# EAGLE design MKL02Z_breakout (EAGLE 7.4.0)
OBC with integrated microcontroller
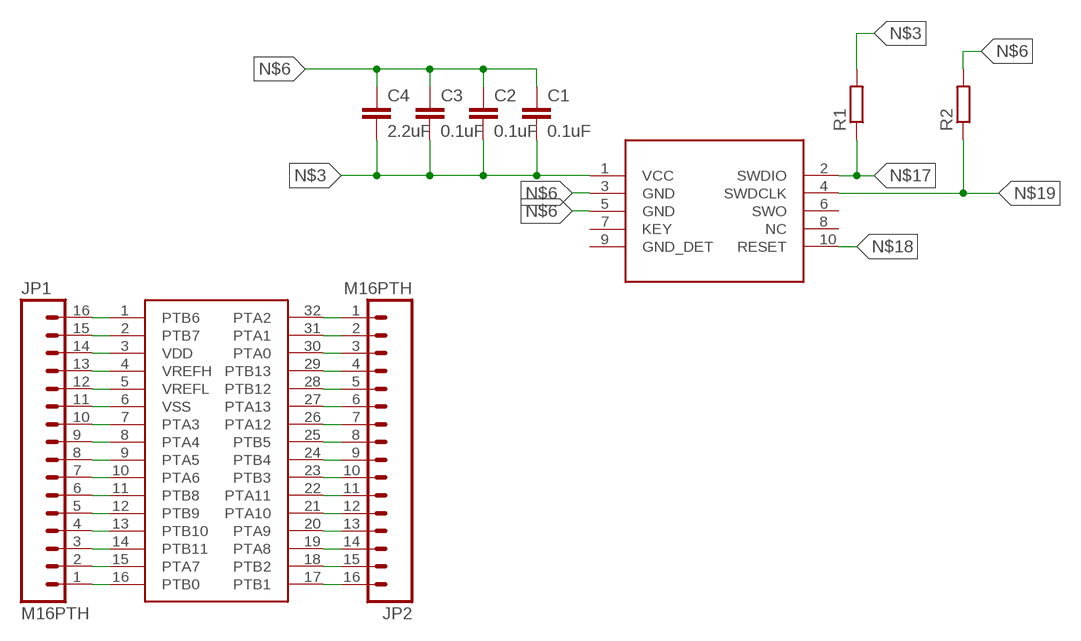
[diagram p0: schematic, sheet 1]

## Parts
C1  0.1uF  C-EUC0603  [C0603]
C2  0.1uF  C-EUC0603  [C0603]
C3  0.1uF  C-EUC0603  [C0603]
C4  2.2uF  C-EUC0603  [C0603]
JP1  M16PTH  [1X16]
JP2  M16PTH  [1X16]
R1  R-EU_R0603  [R0603]
R2  R-EU_R0603  [R0603]
U$1  MKL02Z16VFM4  [MKL02Z16VFM4]
U$2  SWD_10_PIN  [SWD_10_PIN]

## Nets
N$1: JP1.16 U$1.1(PTB6)
N$2: JP1.15 U$1.2(PTB7)
N$3: C1.2 C2.2 C3.2 C4.2 JP1.14 R1.2 U$1.3(VDD) U$2.1(VCC)
N$4: JP1.13 U$1.4(VREFH)
N$5: JP1.12 U$1.5(VREFL)
N$6: C1.1 C2.1 C3.1 C4.1 JP1.11 R2.2 U$1.6(VSS) U$2.3(GND) U$2.5(GND)
N$7: JP1.10 U$1.7(PTA3)
N$8: JP1.9 U$1.8(PTA4)
N$9: JP1.8 U$1.9(PTA5)
N$10: JP1.7 U$1.10(PTA6)
N$11: JP1.6 U$1.11(PTB8)
N$12: JP1.5 U$1.12(PTB9)
N$13: JP1.4 U$1.13(PTB10)
N$14: JP1.3 U$1.14(PTB11)
N$15: JP1.2 U$1.15(PTA7)
N$16: JP1.1 U$1.16(PTB0)
N$17: JP2.1 R1.1 U$1.32(PTA2) U$2.2(SWDIO)
N$18: JP2.2 U$1.31(PTA1) U$2.10(RESET)
N$19: JP2.3 R2.1 U$1.30(PTA0) U$2.4(SWDCLK)
N$20: JP2.4 U$1.29(PTB13)
N$21: JP2.5 U$1.28(PTB12)
N$22: JP2.6 U$1.27(PTA13)
N$23: JP2.7 U$1.26(PTA12)
N$24: JP2.8 U$1.25(PTB5)
N$25: JP2.9 U$1.24(PTB4)
N$26: JP2.10 U$1.23(PTB3)
N$27: JP2.11 U$1.22(PTA11)
N$28: JP2.12 U$1.21(PTA10)
N$29: JP2.13 U$1.20(PTA9)
N$30: JP2.14 U$1.19(PTA8)
N$31: JP2.15 U$1.18(PTB2)
N$32: JP2.16 U$1.17(PTB1)
Unconnected: U$2.6(SWO) U$2.7(KEY) U$2.8(NC) U$2.9(GND_DET)

## Library data of the parts
C1-C4 = resistor:C-EU: CAPACITOR, European symbol
JP1 JP2 = SparkFun-Connectors:M16: 1x16 .1" header
R1 R2 = resistor:R-EU_: RESISTOR, European symbol
U$1 = OBC:MKL02Z16VFM4
U$2 = OBC:SWD_10_PIN

## Net classes
1 USB: width 0.254 mm, clearance 0.159 mm

## Board
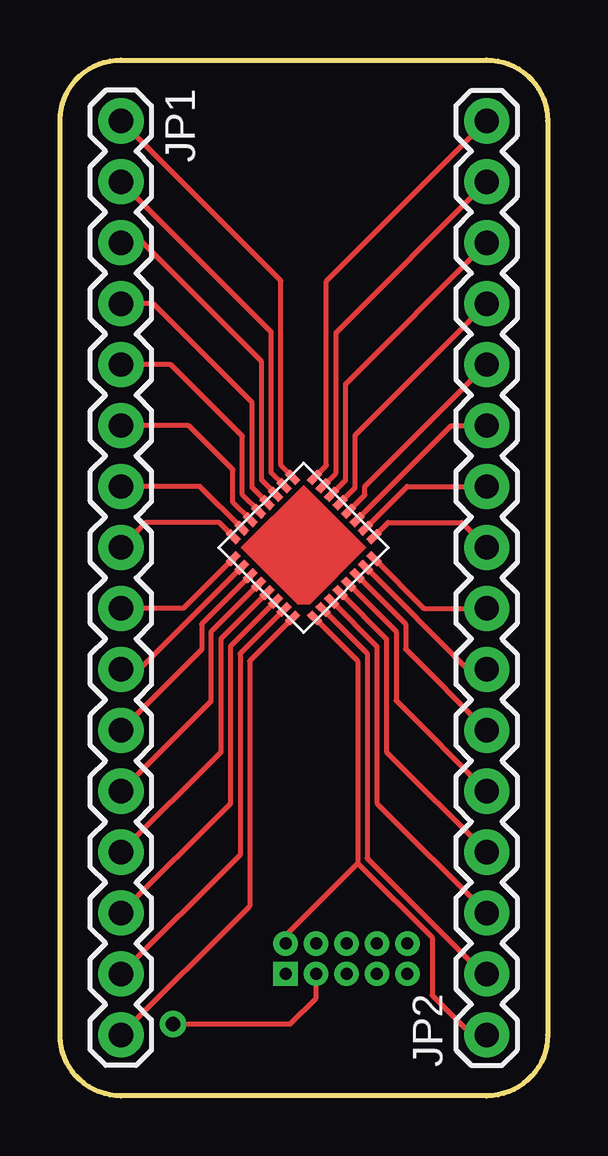
[diagram p1: board, top side]
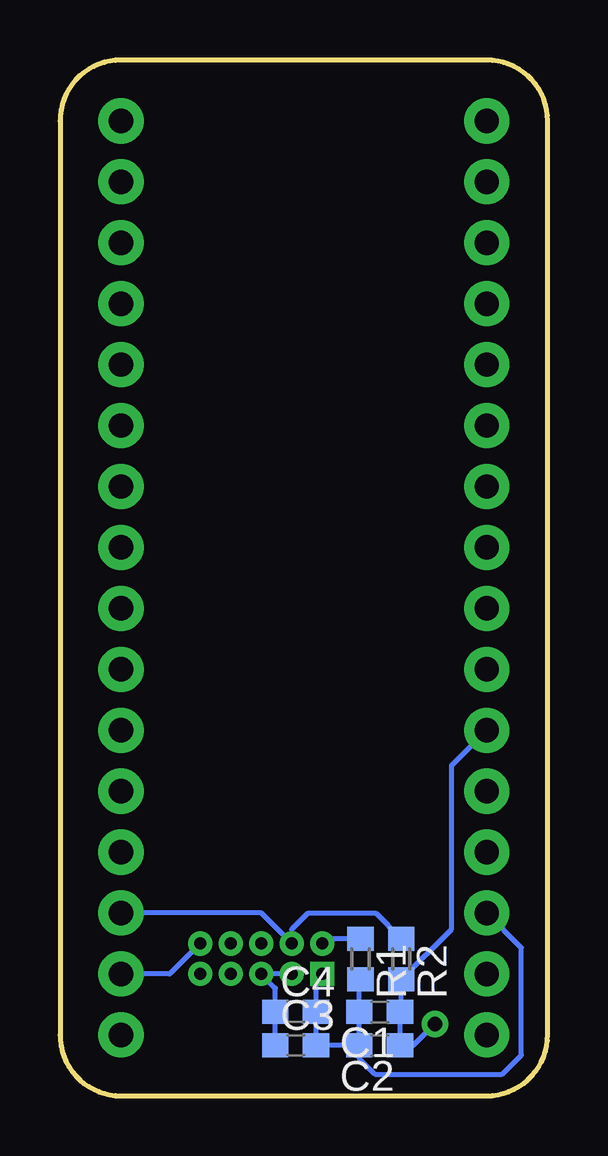
[diagram p2: board, bottom side, seen from below]

Size 20.32 x 43.18 mm. Coordinates in mm from the lower left corner, seen from the top.
Outline: 0,2.54 0,40.64 arc-90 2.54,43.18 17.78,43.18 arc-90 20.32,40.64 20.32,2.54 arc-90 17.78,0 2.54,0 arc-90 0,2.54
Copper layers (1*16): Top 0.035mm / dielectric 1.5mm / Bottom 0.035mm
Design rules "pcbtrain *": minimum track width 0.2mm, minimum drill 0.4mm, track to track 0.2mm, track to pad 0.2mm, pad to pad 0.2mm, via to via 0.2mm, smd to smd 0mil, copper to edge 10mil, drill to drill 0.2mm, minimum pad ring 10mil, minimum via ring 10mil, stop-mask expansion 0.125mm, vias tented up to drill 25mil, thermal gap 10mil

### Footprints (pad centres in the part's own frame; a part is rotated, then mirrored left to right if it is on the bottom)
C0603 = smd 1.1 x 1: 1 -0.85,0; 2 0.85,0
1X16 = drill 1.016 pad 1.88: 1 0,0; 2 2.54,0; 3 5.08,0; 4 7.62,0; 5 10.16,0; 6 12.7,0; 7 15.24,0; 8 17.78,0; 9 20.32,0; 10 22.86,0; 11 25.4,0; 12 27.94,0; 13 30.48,0; 14 33.02,0; 15 35.56,0; 16 38.1,0
R0603 = smd 1 x 1.1: 1 -0.85,0; 2 0.85,0
MKL02Z16VFM4 = smd 0.6 x 0.3: 1 -2.4,-1.75; 2 -2.4,-1.25; 3 -2.4,-0.75; 4 -2.4,-0.25; 5 -2.4,0.25; 6 -2.4,0.75; 7 -2.4,1.25; 8 -2.4,1.75; 17 2.4,1.75; 18 2.4,1.25; 19 2.4,0.75; 20 2.4,0.25; 21 2.4,-0.25; 22 2.4,-0.75; 23 2.4,-1.25; 24 2.4,-1.75 | smd 0.3 x 0.6: 9 -1.75,2.4; 10 -1.25,2.4; 11 -0.75,2.4; 12 -0.25,2.4; 13 0.25,2.4; 14 0.75,2.4; 15 1.25,2.4; 16 1.75,2.4; 25 1.75,-2.4; 26 1.25,-2.4; 27 0.75,-2.4; 28 0.25,-2.4; 29 -0.25,-2.4; 30 -0.75,-2.4; 31 -1.25,-2.4; 32 -1.75,-2.4
SWD_10_PIN = drill 0.5 square: 1 0,5.08 | drill 0.5: 2 1.27,5.08; 3 0,3.81; 4 1.27,3.81; 5 0,2.54; 6 1.27,2.54; 7 0,1.27; 8 1.27,1.27; 9 0,0; 10 1.27,0

### Placement (x,y rotation side)
C1  7,3.5 180 bottom
C2  7,2.1 180 bottom
C3  10.5,2.1 0 bottom
C4  10.5,3.5 0 bottom
JP1  2.54,40.64 270 top
JP2  17.78,2.54 90 top
R1  7.8,5.7 270 bottom
R2  6.1,5.7 270 bottom
U$1  10.15,22.85 45 top
U$2  14.48,5.08 90 top

### Tracks (layer width: path | path; a pad name or v marks a point on that pad's centre or on a via)
N$1
  Top 0.2: U$1.1 7.9,18.12 7.9,7.9 JP1.16
N$2
  Top 0.2: U$1.2 7.5,18.43 7.5,10.04 JP1.15
N$3
  Top 0.2: U$1.3 7.1,18.74 7.1,12.18 JP1.14
  Bottom 0.2: U$2.1 9.65,4.83 C4.2 C3.2 C2.2 | C2.2 C1.2 7.85,4.8 R1.2 | C2.2 7.85,1.55 7.2,0.9 1.9,0.9 1.1,1.7 1.1,6.18 JP1.14
N$4
  Top 0.2: U$1.4 6.7,19.05 6.7,14.32 JP1.13
N$5
  Top 0.2: U$1.5 6.3,19.35 6.3,16.46 JP1.12
N$6  (via drill 0.6)
  Top 0.2: U$1.6 5.9,19.66 5.9,18.6 JP1.11 | v4.7,3 9.6,3 10.67,4.07 U$2.3
  Bottom 0.2: C3.1 C4.1 11.35,4.49 U$2.5 U$2.3 | C2.1 C1.1 6.1,3.55 R2.2 4,6.95 4,13.78 JP1.11 | C2.1 5.8,2.1 | v4.7,3 5.6,2.1 C2.1
N$7
  Top 0.2: U$1.7 3.31,17.78 JP1.10
N$8
  Top 0.2: U$1.8 5.14,20.32 JP1.9
N$9
  Top 0.2: U$1.9 6.62,23.9 3.58,23.9 JP1.8
N$10
  Top 0.2: U$1.10 5.83,25.4 JP1.7
N$11
  Top 0.2: U$1.11 7.2,24.74 7.2,26.1 5.36,27.94 JP1.6
N$12
  Top 0.2: U$1.12 7.6,25.05 7.6,27.5 4.62,30.48 JP1.5
N$13
  Top 0.2: U$1.13 8,25.35 8,28.9 3.88,33.02 JP1.4
N$14
  Top 0.2: U$1.14 8.4,25.66 8.4,30.6 3.44,35.56 JP1.3
N$15
  Top 0.2: U$1.15 8.8,25.97 8.8,31.84 JP1.2
N$16
  Top 0.2: U$1.16 9.2,26.27 9.2,33.98 JP1.1
N$17
  Top 0.2: U$1.32 12.4,18.12 12.4,9.7 | 12.4,9.7 15.5,6.6 15.5,4.2 17.16,2.54 JP2.1 | 12.4,9.7 9.4,6.7 U$2.2
  Bottom 0.2: R1.1 9.2,6.55 U$2.2
N$18
  Top 0.2: U$1.31 12.8,18.43 12.8,9.9 17.62,5.08 JP2.2
  Bottom 0.2: U$2.10 15.75,5.08 JP2.2
N$19
  Top 0.2: U$1.30 13.2,18.74 13.2,12.2 JP2.3
  Bottom 0.2: R2.1 7.15,7.6 10,7.6 10.67,6.93 U$2.4 11.94,7.62 JP2.3
N$20
  Top 0.2: U$1.29 13.6,19.05 13.6,14.34 JP2.4
N$21
  Top 0.2: U$1.28 14,19.35 14,16.48 JP2.5
N$22
  Top 0.2: U$1.27 14.4,19.66 14.4,18.62 JP2.6
N$23
  Top 0.2: U$1.26 16.99,17.78 JP2.7
N$24
  Top 0.2: U$1.25 15.15,20.32 JP2.8
N$25
  Top 0.2: U$1.24 13.68,23.9 16.74,23.9 JP2.9
N$26
  Top 0.2: U$1.23 14.47,25.4 JP2.10
N$27
  Top 0.2: U$1.22 16.3,27.94 JP2.11
N$28
  Top 0.2: U$1.21 12.7,25.05 12.7,25.4 JP2.12
N$29
  Top 0.2: U$1.20 12.3,25.35 12.3,27.54 JP2.13
N$30
  Top 0.2: U$1.19 11.9,25.66 11.9,29.68 JP2.14
N$31
  Top 0.2: U$1.18 11.5,25.97 11.5,31.82 JP2.15
N$32
  Top 0.2: U$1.17 11.1,26.27 11.1,33.96 JP2.16